# EAGLE schematic unoedge (EAGLE 6.5.0)
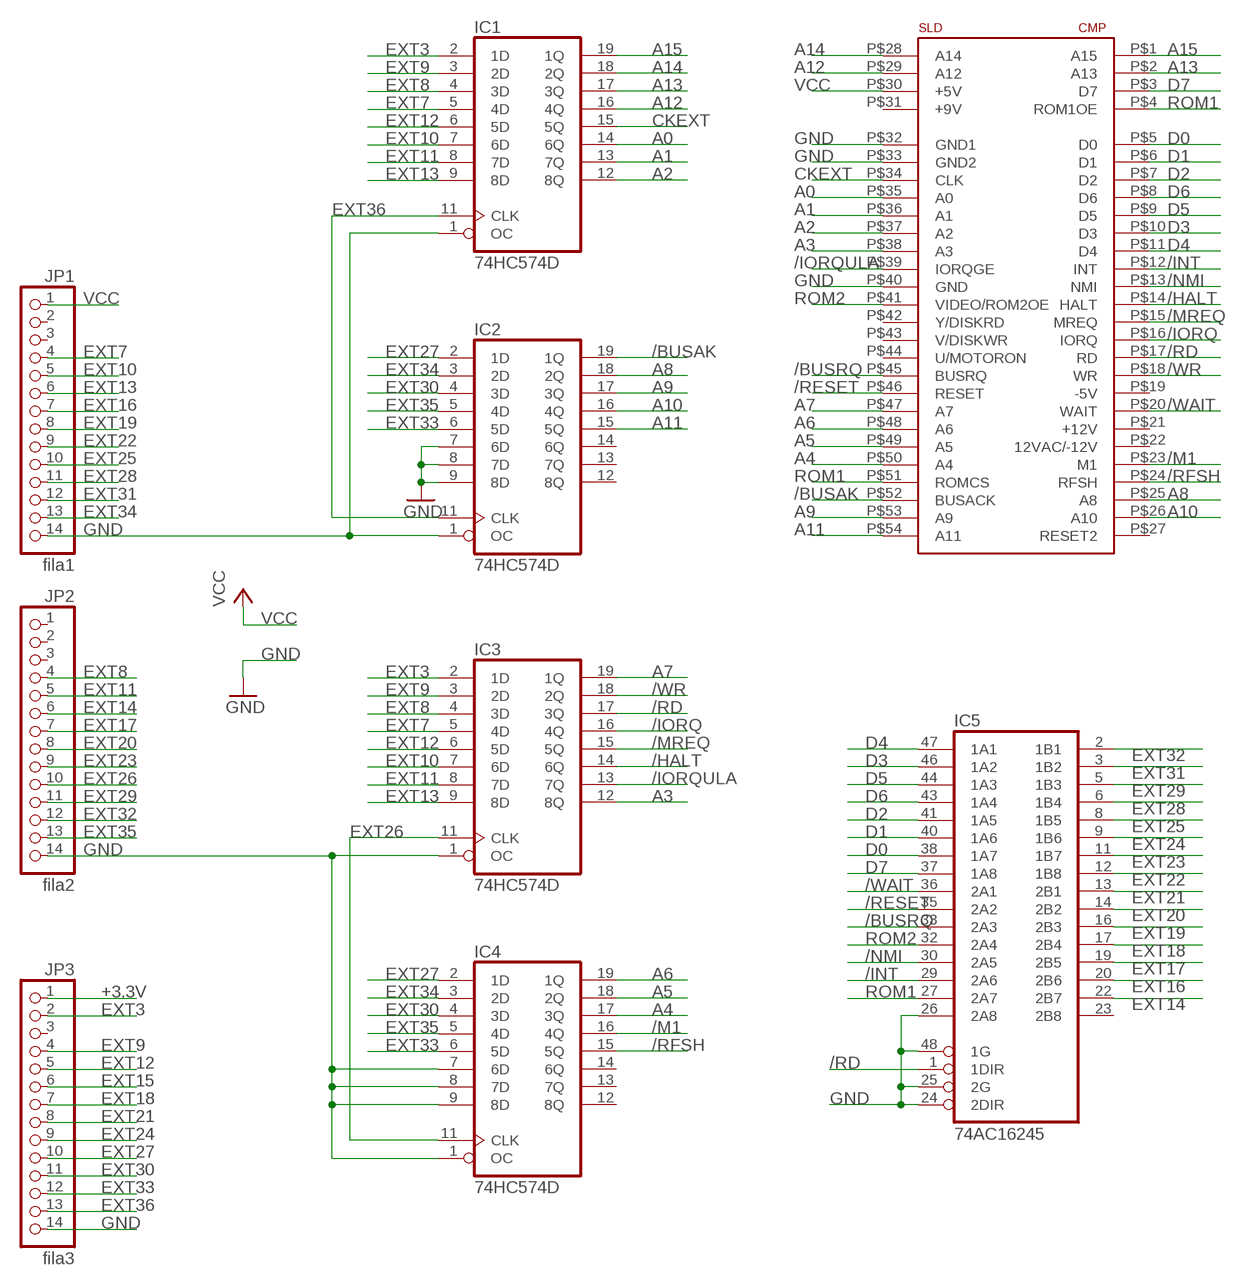
[diagram p0: schematic, sheet 1]

## Parts
IC1  74HC574D  [SO20W]
IC2  74HC574D  [SO20W]
IC3  74HC574D  [SO20W]
IC4  74HC574D  [SO20W]
IC5  74AC16245  [SSOP48DL]
JP1  fila1  PINHD-1X14  [1X14]
JP2  fila2  PINHD-1X14  [1X14]
JP3  fila3  PINHD-1X14  [1X14]
U$2  CONECTOR_EDGE_LADO_SPECTRUM  [CONECTOR_LADO_SPECTRUM]

## Nets
+3.3V: JP3.1
/BUSAK: IC2.19(1Q) U$2.P$52(BUSACK)
/BUSRQ: IC5.33(2A3) U$2.P$45(BUSRQ)
/HALT: IC3.14(6Q) U$2.P$14(HALT)
/INT: IC5.29(2A6) U$2.P$12(INT)
/IORQ: IC3.16(4Q) U$2.P$16(IORQ)
/IORQULA: IC3.13(7Q) U$2.P$39(IORQGE)
/M1: IC4.16(4Q) U$2.P$23(M1)
/MREQ: IC3.15(5Q) U$2.P$15(MREQ)
/NMI: IC5.30(2A5) U$2.P$13(NMI)
/RD: IC3.17(3Q) IC5.1(1DIR) U$2.P$17(RD)
/RESET: IC5.35(2A2) U$2.P$46(RESET)
/RFSH: IC4.15(5Q) U$2.P$24(RFSH)
/WAIT: IC5.36(2A1) U$2.P$20(WAIT)
/WR: IC3.18(2Q) U$2.P$18(WR)
A0: IC1.14(6Q) U$2.P$35(A0)
A1: IC1.13(7Q) U$2.P$36(A1)
A2: IC1.12(8Q) U$2.P$37(A2)
A3: IC3.12(8Q) U$2.P$38(A3)
A4: IC4.17(3Q) U$2.P$50(A4)
A5: IC4.18(2Q) U$2.P$49(A5)
A6: IC4.19(1Q) U$2.P$48(A6)
A7: IC3.19(1Q) U$2.P$47(A7)
A8: IC2.18(2Q) U$2.P$25(A8)
A9: IC2.17(3Q) U$2.P$53(A9)
A10: IC2.16(4Q) U$2.P$26(A10)
A11: IC2.15(5Q) U$2.P$54(A11)
A12: IC1.16(4Q) U$2.P$29(A12)
A13: IC1.17(3Q) U$2.P$2(A13)
A14: IC1.18(2Q) U$2.P$28(A14)
A15: IC1.19(1Q) U$2.P$1(A15)
CKEXT: IC1.15(5Q) U$2.P$34(CLK)
D0: IC5.38(1A7) U$2.P$5(D0)
D1: IC5.40(1A6) U$2.P$6(D1)
D2: IC5.41(1A5) U$2.P$7(D2)
D3: IC5.46(1A2) U$2.P$10(D3)
D4: IC5.47(1A1) U$2.P$11(D4)
D5: IC5.44(1A3) U$2.P$9(D5)
D6: IC5.43(1A4) U$2.P$8(D6)
D7: IC5.37(1A8) U$2.P$3(D7)
EXT3: IC1.2(1D) IC3.2(1D) JP3.2
EXT7: IC1.5(4D) IC3.5(4D) JP1.4
EXT8: IC1.4(3D) IC3.4(3D) JP2.4
EXT9: IC1.3(2D) IC3.3(2D) JP3.4
EXT10: IC1.7(6D) IC3.7(6D) JP1.5
EXT11: IC1.8(7D) IC3.8(7D) JP2.5
EXT12: IC1.6(5D) IC3.6(5D) JP3.5
EXT13: IC1.9(8D) IC3.9(8D) JP1.6
EXT14: IC5.22(2B7) JP2.6
EXT15: JP3.6
EXT16: IC5.20(2B6) JP1.7
EXT17: IC5.19(2B5) JP2.7
EXT18: IC5.17(2B4) JP3.7
EXT19: IC5.16(2B3) JP1.8
EXT20: IC5.14(2B2) JP2.8
EXT21: IC5.13(2B1) JP3.8
EXT22: IC5.12(1B8) JP1.9
EXT23: IC5.11(1B7) JP2.9
EXT24: IC5.9(1B6) JP3.9
EXT25: IC5.8(1B5) JP1.10
EXT26: IC3.11(CLK) IC4.11(CLK) JP2.10
EXT27: IC2.2(1D) IC4.2(1D) JP3.10
EXT28: IC5.6(1B4) JP1.11
EXT29: IC5.5(1B3) JP2.11
EXT30: IC2.4(3D) IC4.4(3D) JP3.11
EXT31: IC5.3(1B2) JP1.12
EXT32: IC5.2(1B1) JP2.12
EXT33: IC2.6(5D) IC4.6(5D) JP3.12
EXT34: IC2.3(2D) IC4.3(2D) JP1.13
EXT35: IC2.5(4D) IC4.5(4D) JP2.13
EXT36: IC1.11(CLK) IC2.11(CLK) JP3.13
GND: IC1.1(OC) IC2.1(OC) IC2.7(6D) IC2.8(7D) IC2.9(8D) IC3.1(OC) IC4.1(OC) IC4.7(6D) IC4.8(7D) IC4.9(8D) IC5.24(2DIR) IC5.25(2G) IC5.26(2A8) IC5.48(1G) JP1.14 JP2.14 JP3.14 U$2.P$32(GND1) U$2.P$33(GND2) U$2.P$40(GND)
ROM1: IC5.27(2A7) U$2.P$4(ROM1OE) U$2.P$51(ROMCS)
ROM2: IC5.32(2A4) U$2.P$41(VIDEO/ROM2OE)
VCC: JP1.1 U$2.P$30(+5V)
Unconnected: IC2.12(8Q) IC2.13(7Q) IC2.14(6Q) IC4.12(8Q) IC4.13(7Q) IC4.14(6Q) IC5.23(2B8) JP1.2 JP1.3 JP2.1 JP2.2 JP2.3 JP3.3 U$2.P$19(-5V) U$2.P$21(+12V) U$2.P$22(12VAC/-12V) U$2.P$27(RESET2) U$2.P$31(+9V) U$2.P$42(Y/DISKRD) U$2.P$43(V/DISKWR) U$2.P$44(U/MOTORON)

## Power pins joined to a net without a drawn wire
GND: IC1.10(GND) IC2.10(GND) IC3.10(GND) IC4.10(GND) IC5.4(GND) IC5.10(GND) IC5.15(GND) IC5.21(GND) IC5.28(GND) IC5.34(GND) IC5.39(GND) IC5.45(GND)
VCC: IC1.20(VCC) IC2.20(VCC) IC3.20(VCC) IC4.20(VCC) IC5.7(VCC) IC5.18(VCC) IC5.31(VCC) IC5.42(VCC)

## Library data of the parts
IC1-IC4 = 74xx-eu:74*574: 8-bit D type FLIP FLOP bus driver
IC5 = 74ac-logic:74AC16245: 16-bit BUS TRANSCEIVER, 3-state
JP1-JP3 = pinhead:PINHD-1X14: PIN HEADER
U$2 = zx_bus_connector_lado_spectrum:CONECTOR_EDGE_LADO_SPECTRUM